# EAGLE design dwm1000addon (EAGLE 8.2.2)
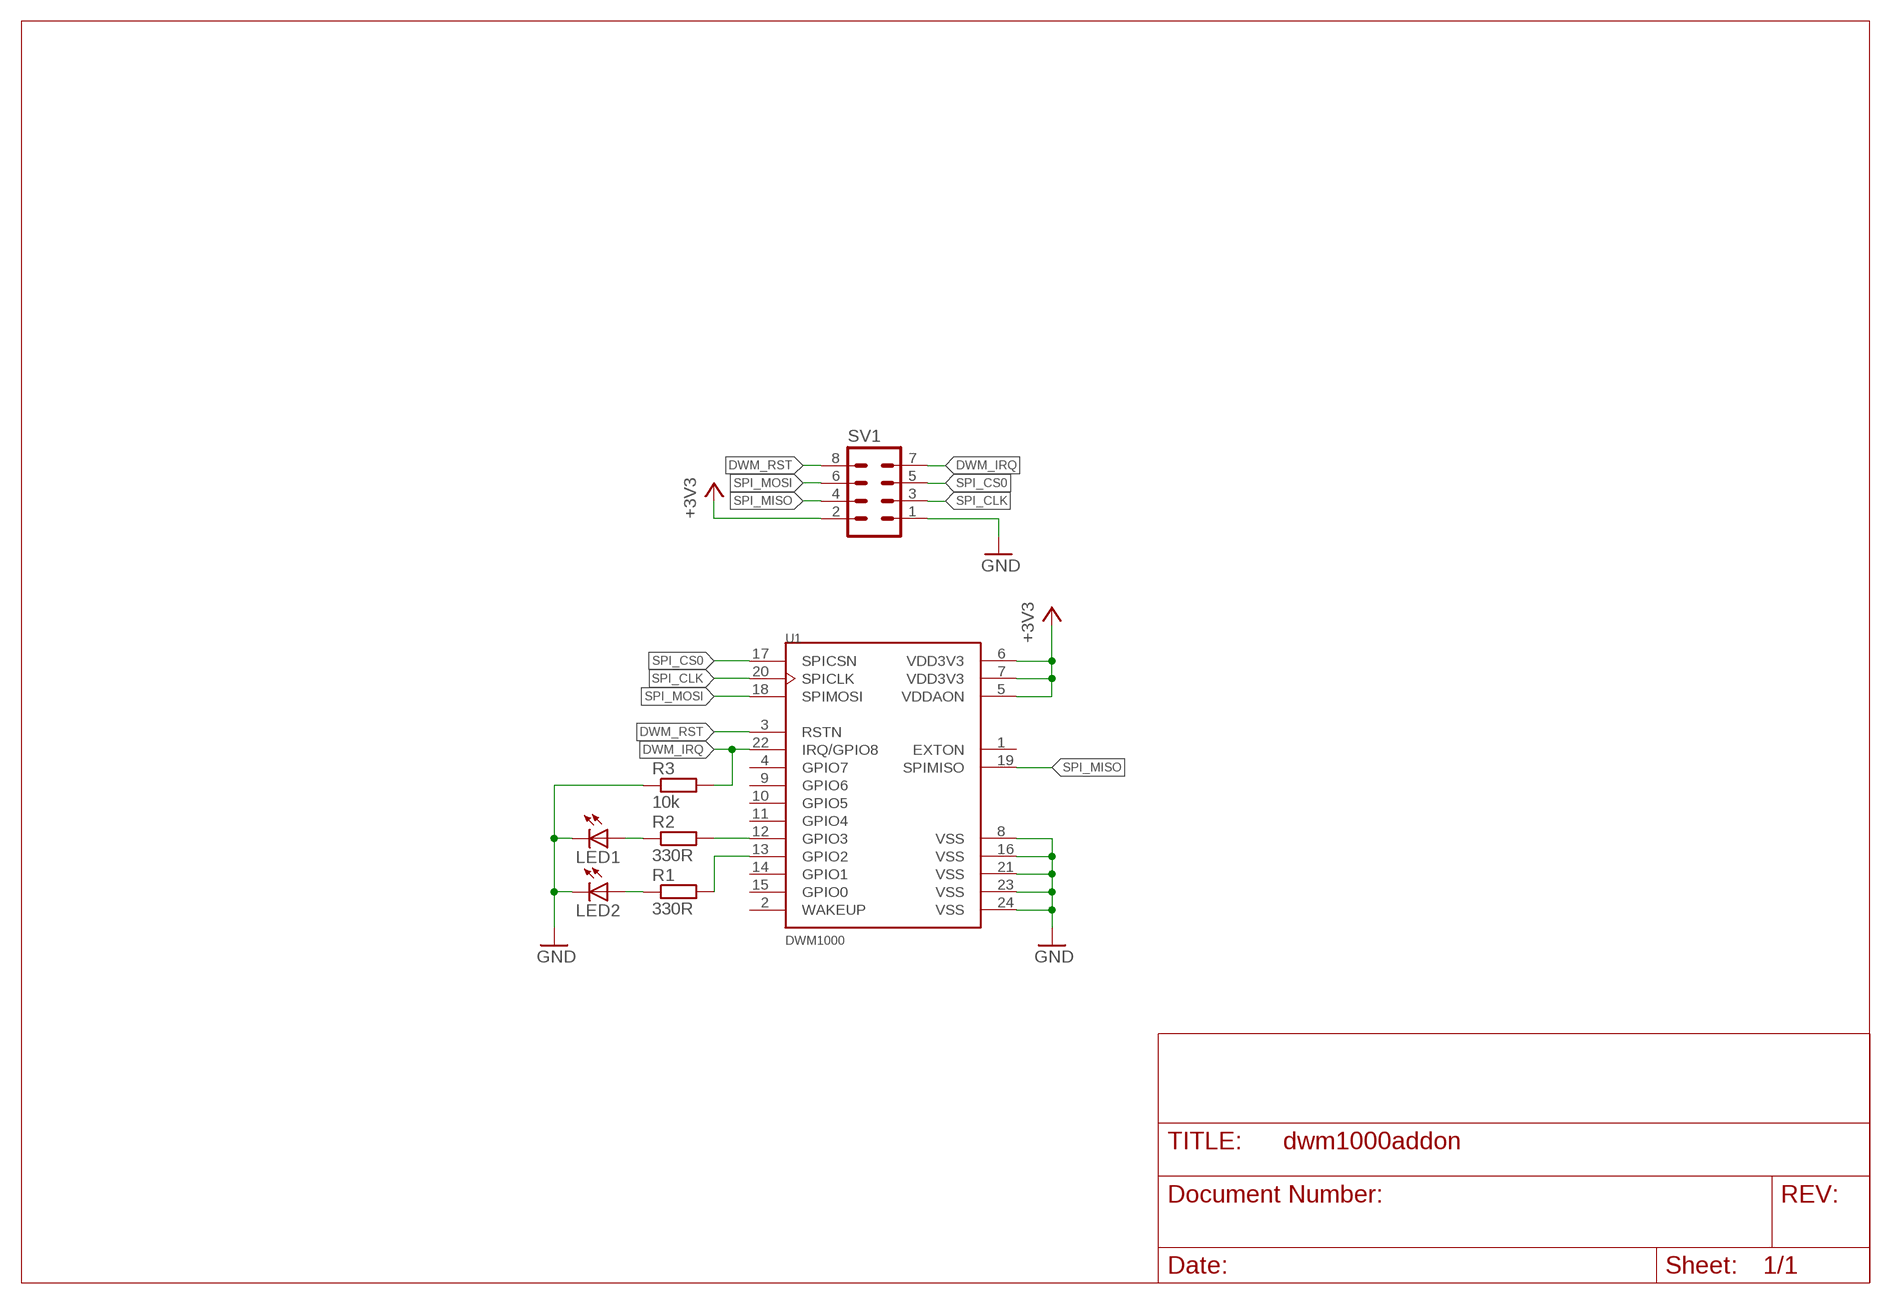
[diagram p0: schematic, sheet 1]

## Parts
LED1  LEDCHIPLED_0603  [CHIPLED_0603]
LED2  LEDCHIPLED_0603  [CHIPLED_0603]
R1  330R  R-EU_R0603  [R0603]
R2  330R  R-EU_R0603  [R0603]
R3  10k  R-EU_R0603  [R0603]
SV1  MA04-2  [MA04-2]
U1  DWM1000  [XCVR_DWM1000]

## Nets
+3V3: SV1.2 U1.5(VDDAON) U1.6(VDD3V3) U1.7(VDD3V3)
DWM_IRQ: R3.2 SV1.7 U1.22(IRQ/GPIO8)
DWM_RST: SV1.8 U1.3(RSTN)
GND: LED1.C LED2.C R3.1 SV1.1 U1.8(VSS) U1.16(VSS) U1.21(VSS) U1.23(VSS) U1.24(VSS)
N$6: LED2.A R1.1
N$9: R1.2 U1.13(GPIO2)
N$10: R2.2 U1.12(GPIO3)
N$12: LED1.A R2.1
SPI_CLK: SV1.3 U1.20(SPICLK)
SPI_CS0: SV1.5 U1.17(SPICSN)
SPI_MISO: SV1.4 U1.19(SPIMISO)
SPI_MOSI: SV1.6 U1.18(SPIMOSI)
Unconnected: U1.1(EXTON) U1.2(WAKEUP) U1.4(GPIO7) U1.9(GPIO6) U1.10(GPIO5) U1.11(GPIO4) U1.14(GPIO1) U1.15(GPIO0)

## Library data of the parts
LED1 LED2 = led:LED: LED OSRAM: - CHIPLED LG R971, LG N971, LY N971, LG Q971, LY Q971, LO R971, LY R971 LH N974, LH R974 LS Q976, LO Q976, LY Q976 LO Q996 - Hyper CHIPLED LW Q18S LB Q993, LB Q99A, LB R99A - SideLED LS A670, LO A670, LY A670, LG A670, LP A670 LB A673, LV A673, LT A673, LW A673 LH A674 LY A675 LS A676, LA A676, LO A676, LY A676, LW A676 LS A679, LY A679, LG A679 - Hyper Micro SIDELED® LS Y876, LA Y876, LO Y876, LY Y876 LT Y87S - SmartLED LW L88C, LW L88S LB L89C, LB L89S, LG L890 LS L89K, LO L89K, LY L89K LS L896, LA L896, LO L896, LY L896 - TOPLED LS T670, LO T670, LY T670, LG T670, LP T670 LSG T670, LSP T670, LSY T670, LOP T670, LYG T670 LG T671, LOG T671, LSG T671 LB T673, LV T673, LT T673, LW T673 LH T674 LS T676, LA T676, LO T676, LY T676, LB T676, LH T676, LSB T676, LW T676 LB T67C, LV T67C, LT T67C, LS T67K, LO T67K, LY T67K, LW E67C LS E67B, LA E67B, LO E67B, LY E67B, LB E67C, LV E67C, LT E67C LW T67C LS T679, LY T679, LG T679 LS T770, LO T770, LY T770, LG T770, LP T770 LB T773, LV T773, LT T773, LW T773 LH T774 LS E675, LA E675, LY E675, LS T675 LS T776, LA T776, LO T776, LY T776, LB T776 LHGB T686 LT T68C, LB T68C - Hyper Mini TOPLED® LB M676 - Mini TOPLED Santana® LG M470 LS M47K, LO M47K, LY M47K Source: http://www.osram.convergy.de LUXEON: - LUMILED® LXK2-PW12-R00, LXK2-PW12-S00, LXK2-PW14-U00, LXK2-PW14-V00 LXK2-PM12-R00, LXK2-PM12-S00, LXK2-PM14-U00 LXK2-PE12-Q00, LXK2-PE12-R00, LXK2-PE12-S00, LXK2-PE14-T00, LXK2-PE14-U00 LXK2-PB12-K00, LXK2-PB12-L00, LXK2-PB12-M00, LXK2-PB14-N00, LXK2-PB14-P00, LXK2-PB14-Q00 LXK2-PR12-L00, LXK2-PR12-M00, LXK2-PR14-Q00, LXK2-PR14-R00 LXK2-PD12-Q00, LXK2-PD12-R00, LXK2-PD12-S00 LXK2-PH12-R00, LXK2-PH12-S00 LXK2-PL12-P00, LXK2-PL12-Q00, LXK2-PL12-R00 Source: www.luxeon.com KINGBRIGHT: KA-3528ASYC Source: www.kingbright.com
R1-R3 = resistor:R-EU_: RESISTOR, European symbol
SV1 = con-lstb:MA04-2: PIN HEADER; OC_FARNELL: unknown; OC_NEWARK: unknown
U1 = DWM1000:DWM1000: Mod Ieee802.15.4-2011 Uwb Txrx

## Board
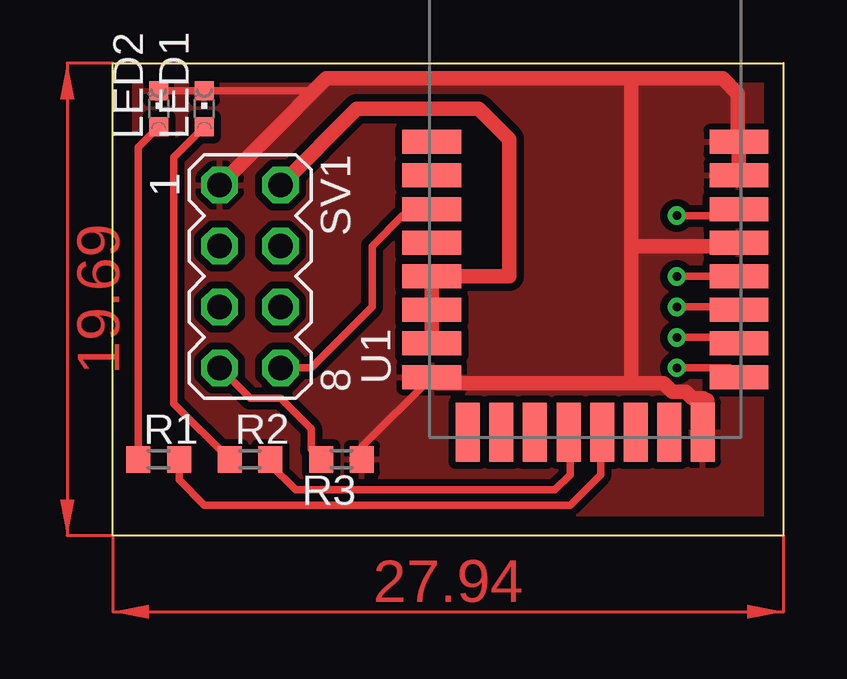
[diagram p1: board, top side]
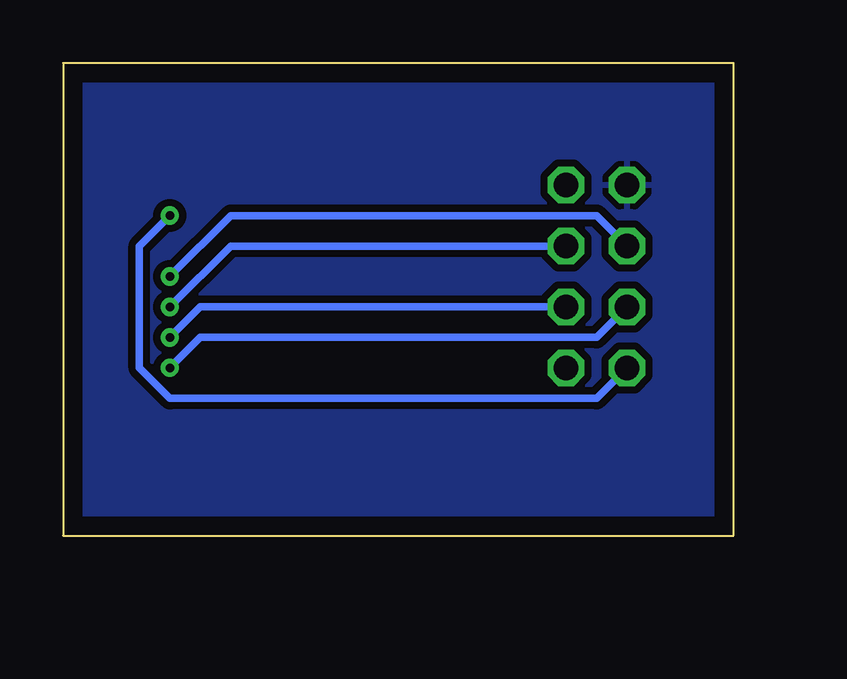
[diagram p2: board, bottom side, seen from below]

Size 27.94 x 19.69 mm. Coordinates in mm from the lower left corner, seen from the top.
Outline: 0,0 0,19.69 27.94,19.69 27.94,0 0,0
Copper layers (1*16): Top 0.035mm / dielectric 1.5mm / Bottom 0.035mm
Design rules "default *": minimum track width 6mil, minimum drill 0.35mm, track to track 6mil, track to pad 6mil, pad to pad 6mil, via to via 6mil, smd to smd 6mil, copper to edge 30mil, drill to drill 6mil, minimum pad ring 10mil, minimum via ring 8mil, stop-mask expansion 4mil, vias tented up to drill 0mil, thermal gap 10mil

### Footprints (pad centres in the part's own frame; a part is rotated, then mirrored left to right if it is on the bottom)
CHIPLED_0603 = smd 0.8 x 0.8: A 0,-0.75; C 0,0.75
R0603 = smd 1 x 1.1: 1 -0.85,0; 2 0.85,0
MA04-2 = drill 1.016 octagon: 1 -3.81,-1.27; 2 -3.81,1.27; 3 -1.27,-1.27; 4 -1.27,1.27; 5 1.27,-1.27; 6 1.27,1.27; 7 3.81,-1.27; 8 3.81,1.27
XCVR_DWM1000 = smd 2.45 x 1: 1 -6.4,1.8; 2 -6.4,0.4; 3 -6.4,-1; 4 -6.4,-2.4; 5 -6.4,-3.8; 6 -6.4,-5.2; 7 -6.4,-6.6; 8 -6.4,-8; 17 6.4,-8; 18 6.4,-6.6; 19 6.4,-5.2; 20 6.4,-3.8; 21 6.4,-2.4; 22 6.4,-1; 23 6.4,0.4; 24 6.4,1.8 | smd 1 x 2.45: 9 -4.9,-10.295; 10 -3.5,-10.295; 11 -2.1,-10.295; 12 -0.7,-10.295; 13 0.7,-10.295; 14 2.1,-10.295; 15 3.5,-10.295; 16 4.9,-10.295

### Placement (x,y rotation side)
LED1  3.81,17.78 0 top
LED2  1.9,17.78 0 top
R1  1.9,3.18 0 top
R2  5.72,3.18 0 top
R3  9.53,3.18 180 top
SV1  5.72,10.8 270 top
U1  19.69,14.61 0 top

### Tracks (layer width: path | path; a pad name or v marks a point on that pad's centre or on a via)
+3V3
  Top 0.61: U1.7 U1.6 U1.5 16.51,10.8 16.51,16.51 15.24,17.78 10.16,17.78 SV1.2
DWM_IRQ  (via drill 0.35)
  Top 0.305: v23.49,13.34 25.81,13.34 U1.22 | SV1.7 5.72,5.71 6.99,5.71 8.26,4.45 8.26,3.6 R3.2
  Bottom 0.305: SV1.7 5.72,5.71 23.49,5.71 24.77,6.98 24.77,12.07 v23.49,13.34
DWM_RST
  Top 0.305: SV1.8 8.26,6.98 10.79,9.53 10.79,12.07 12.06,13.34 13.01,13.34 U1.3
GND
  Top 0.305: R3.1 10.38,3.7 U1.8 | 7.03,17.26 7.07,17.23 | LED2.C LED1.C 8.28,18.53 8.32,18.48
  Top 0.61: U1.23 U1.24 26.03,16.45 26.03,18.41 25.4,19.05 21.59,19.05 | SV1.1 7.07,17.23 8.32,18.48 8.89,19.05 21.59,19.05 | 21.59,19.05 21.59,12.07 | 21.59,12.07 25.95,12.07 U1.21 | 21.59,6.35 13.54,6.35 U1.8 | 21.59,12.07 21.59,6.35 | 21.59,6.35 22.95,6.35 23.31,5.99 23.87,5.99 24.14,5.72 24.14,5.71 24.6,5.71 24.67,5.65 24.77,5.65 24.77,4.49 U1.16
  pour Top (isolate 0.305): 0,19.69 27.94,19.69 27.94,0 0,0
  pour Bottom (isolate 0.305): 0,19.69 27.94,19.69 27.94,0 0,0
N$6
  Top 0.305: R1.1 1.05,16.18 LED2.A
N$9
  Top 0.305: R1.2 2.76,2.32 3.81,1.27 19.05,1.27 20.32,2.54 20.32,4.25 U1.13
N$10
  Top 0.305: R2.2 6.56,2.96 7.62,1.91 18.41,1.91 19.05,2.54 19.05,4.25 U1.12
N$12
  Top 0.305: R2.1 2.54,5.5 2.54,15.76 LED1.A
SPI_CLK  (via drill 0.35)
  Top 0.305: v23.49,10.8 U1.20
  Bottom 0.305: SV1.3 5.72,13.34 20.95,13.34 v23.49,10.8
SPI_CS0  (via drill 0.35)
  Top 0.305: v23.49,6.98 25.7,6.98 U1.17
  Bottom 0.305: SV1.5 5.72,8.26 22.23,8.26 v23.49,6.98
SPI_MISO  (via drill 0.35)
  Top 0.305: v23.49,9.53 25.96,9.53 U1.19
  Bottom 0.305: SV1.4 20.95,12.07 v23.49,9.53
SPI_MOSI  (via drill 0.35)
  Top 0.305: v23.49,8.26 25.84,8.26 U1.18
  Bottom 0.305: SV1.6 22.23,9.53 v23.49,8.26
(copper drawn outside any net)
  shapes: Top area x2